# EAGLE design 7Segment (EAGLE 5.11)
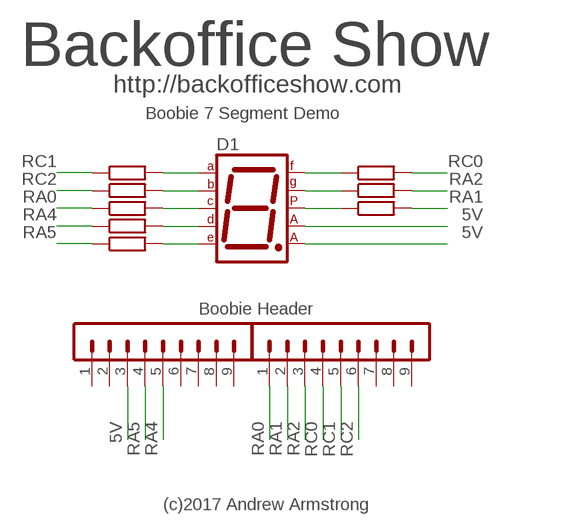
[diagram p0: schematic, sheet 1]

## Parts
D1  7SEG-CA  [7SEG-13]
R1  330R  R-EU_0207/10  [0207/10]
R2  330R  R-EU_0207/10  [0207/10]
R3  330R  R-EU_0207/10  [0207/10]
R4  330R  R-EU_0207/10  [0207/10]
R5  330R  R-EU_0207/10  [0207/10]
R6  330R  R-EU_0207/10  [0207/10]
R7  330R  R-EU_0207/10  [0207/10]
R8  330R  R-EU_0207/10  [0207/10]
SV1  MA09-1  [MA09-1]
SV2  MA09-1  [MA09-1]

## Nets
5V: D1.3(CA1) D1.8(CA2) SV2.3
N$1: D1.7(A) R1.2
N$2: D1.6(B) R2.2
N$3: D1.4(C) R3.2
N$4: D1.2(D) R4.2
N$5: D1.1(E) R5.2
N$6: D1.9(F) R6.1
N$7: D1.10(G) R7.1
N$8: D1.5(DP) R8.1
RA0: R3.1 SV1.1
RA1: R8.2 SV1.2
RA2: R7.2 SV1.3
RA4: R4.1 SV2.5
RA5: R5.1 SV2.4
RC0: R6.2 SV1.4
RC1: R1.1 SV1.5
RC2: R2.1 SV1.6
Unconnected: SV1.7 SV1.8 SV1.9 SV2.1 SV2.2 SV2.6 SV2.7 SV2.8 SV2.9

## Notes on the sheet
- Backoffice Show
- http://backofficeshow.com
- Boobie 7 Segment Demo
- Boobie Header
- (c)2017 Andrew Armstrong

## Library data of the parts
D1 = special:7SEG-CA: 7-segment DISPLAY single anode, 13 mm
R1-R8 = rcl:R-EU_: RESISTOR, European symbol
SV1 SV2 = con-lstb:MA09-1: PIN HEADER; OC_FARNELL: unknown; OC_NEWARK: unknown

## Board
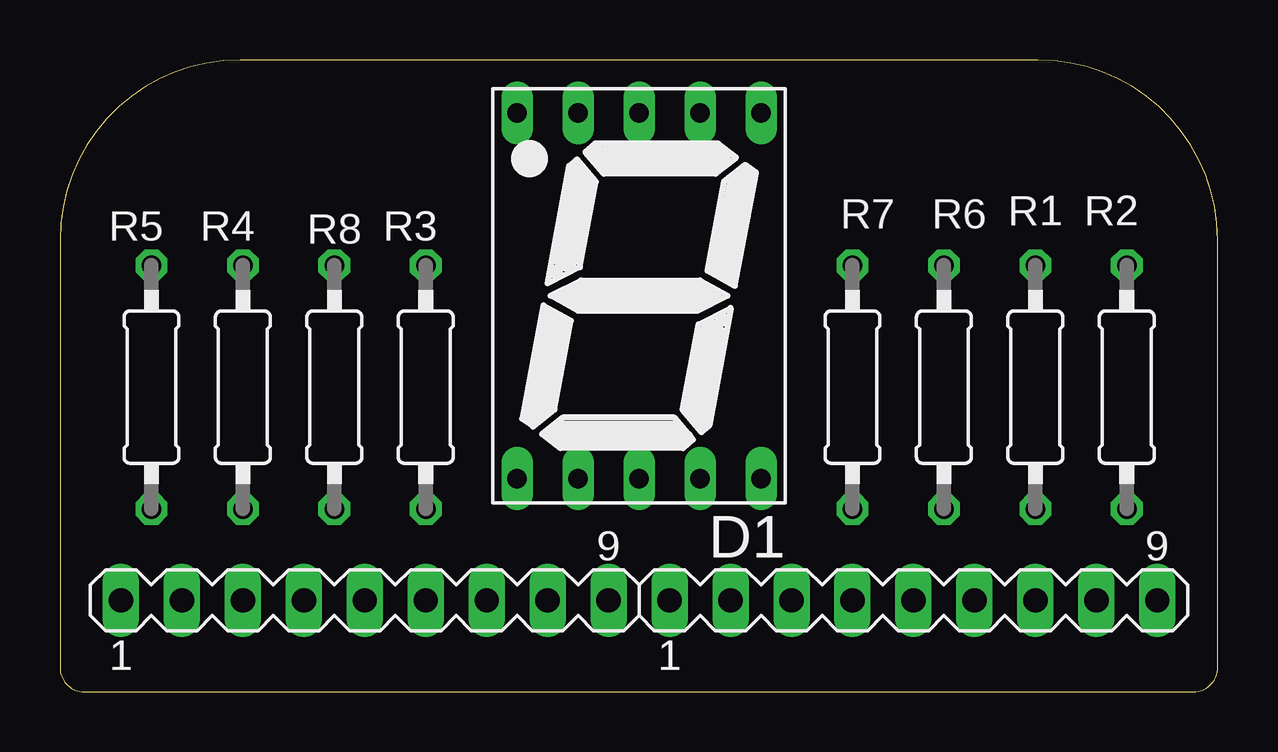
[diagram p1: board, top side]
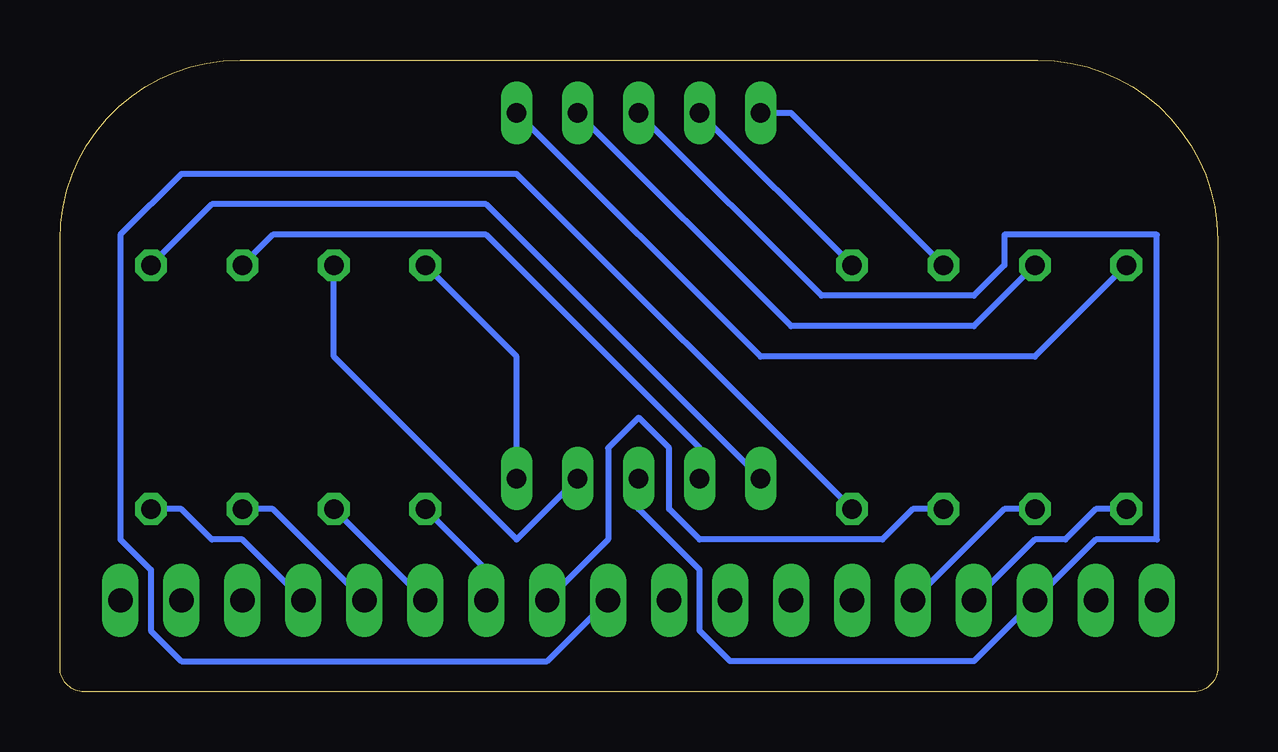
[diagram p2: board, bottom side, seen from below]

Size 48.24 x 26.34 mm. Coordinates in mm from the lower left corner, seen from the top.
Outline: 47.24,0 arc90 48.24,1 48.24,18.84 arc90 40.74,26.34 7.5,26.34 arc90 0,18.84 0,1 arc90 1,0 47.24,0
Copper layers (1*16): Top 0.035mm / dielectric 1.5mm / Bottom 0.035mm
Design rules "default": minimum track width 10mil, minimum drill 24mil, track to track 8mil, track to pad 8mil, pad to pad 8mil, via to via 8mil, smd to smd 8mil, copper to edge 40mil, drill to drill 8mil, minimum pad ring 10mil, minimum via ring 8mil, stop-mask expansion 4mil, vias tented up to drill 0mil, thermal gap 10mil

### Footprints (pad centres in the part's own frame; a part is rotated, then mirrored left to right if it is on the bottom)
7SEG-13 = drill 0.813 long: 1 -5.08,-7.62; 2 -2.54,-7.62; 3 0,-7.62; 4 2.54,-7.62; 5 5.08,-7.62; 6 5.08,7.62; 7 2.54,7.62; 8 0,7.62; 9 -2.54,7.62; 10 -5.08,7.62
0207/10 = drill 0.813 octagon: 1 -5.08,0; 2 5.08,0
MA09-1 = drill 1.016 long: 1 -10.16,0; 2 -7.62,0; 3 -5.08,0; 4 -2.54,0; 5 0,0; 6 2.54,0; 7 5.08,0; 8 7.62,0; 9 10.16,0

### Placement (x,y rotation side)
D1  24.13,16.51 180 top
R1  40.64,12.7 90 top
R2  44.45,12.7 90 top
R3  15.24,12.7 90 top
R4  7.62,12.7 90 top
R5  3.81,12.7 90 top
R6  36.83,12.7 270 top
R7  33.02,12.7 270 top
R8  11.43,12.7 270 top
SV1  35.56,3.81 0 top
SV2  12.7,3.81 0 top

### Tracks (layer width: path | path; a pad name or v marks a point on that pad's centre or on a via)
5V
  Bottom 0.254: D1.8 24.13,7.62 21.59,5.08 21.59,2.54 20.32,1.27 10.16,1.27 SV2.3 5.08,6.35 2.54,6.35 2.54,19.05 8.89,19.05 8.89,17.78 10.16,16.51 16.51,16.51 D1.3
N$1
  Bottom 0.254: D1.7 21.59,10.16 30.48,19.05 39.37,19.05 R1.2
N$2
  Bottom 0.254: D1.6 30.48,20.32 41.91,20.32 R2.2
N$3
  Bottom 0.254: R3.2 D1.4
N$4
  Bottom 0.254: R4.2 10.16,15.24 17.78,15.24 D1.2
N$5
  Bottom 0.254: R5.2 7.62,13.97 19.05,13.97 D1.1
N$6
  Bottom 0.254: D1.9 29.21,6.35 36.83,13.97 R6.1
N$7
  Bottom 0.254: D1.10 29.21,13.97 R7.1
N$8
  Bottom 0.254: R8.1 17.78,24.13 D1.5
RA0
  Bottom 0.254: R3.1 29.21,21.59 43.18,21.59 45.72,19.05 45.72,6.35 44.45,5.08 44.45,2.54 43.18,1.27 27.94,1.27 SV1.1
RA1
  Bottom 0.254: R8.2 12.7,7.62 13.97,6.35 21.59,6.35 22.86,7.62 22.86,10.16 24.13,11.43 25.4,10.16 25.4,6.35 SV1.2
RA2
  Bottom 0.254: R7.2 30.48,5.08 SV1.3
RA4
  Bottom 0.254: R4.1 8.89,7.62 SV2.5
RA5
  Bottom 0.254: R5.1 5.08,7.62 6.35,6.35 7.62,6.35 SV2.4
RC0
  Bottom 0.254: SV1.4 R6.2
RC1
  Bottom 0.254: R1.1 39.37,7.62 SV1.5
RC2
  Bottom 0.254: R2.1 43.18,7.62 41.91,6.35 40.64,6.35 SV1.6